# EAGLE schematic schematic_sensors (EAGLE 9.6.1)
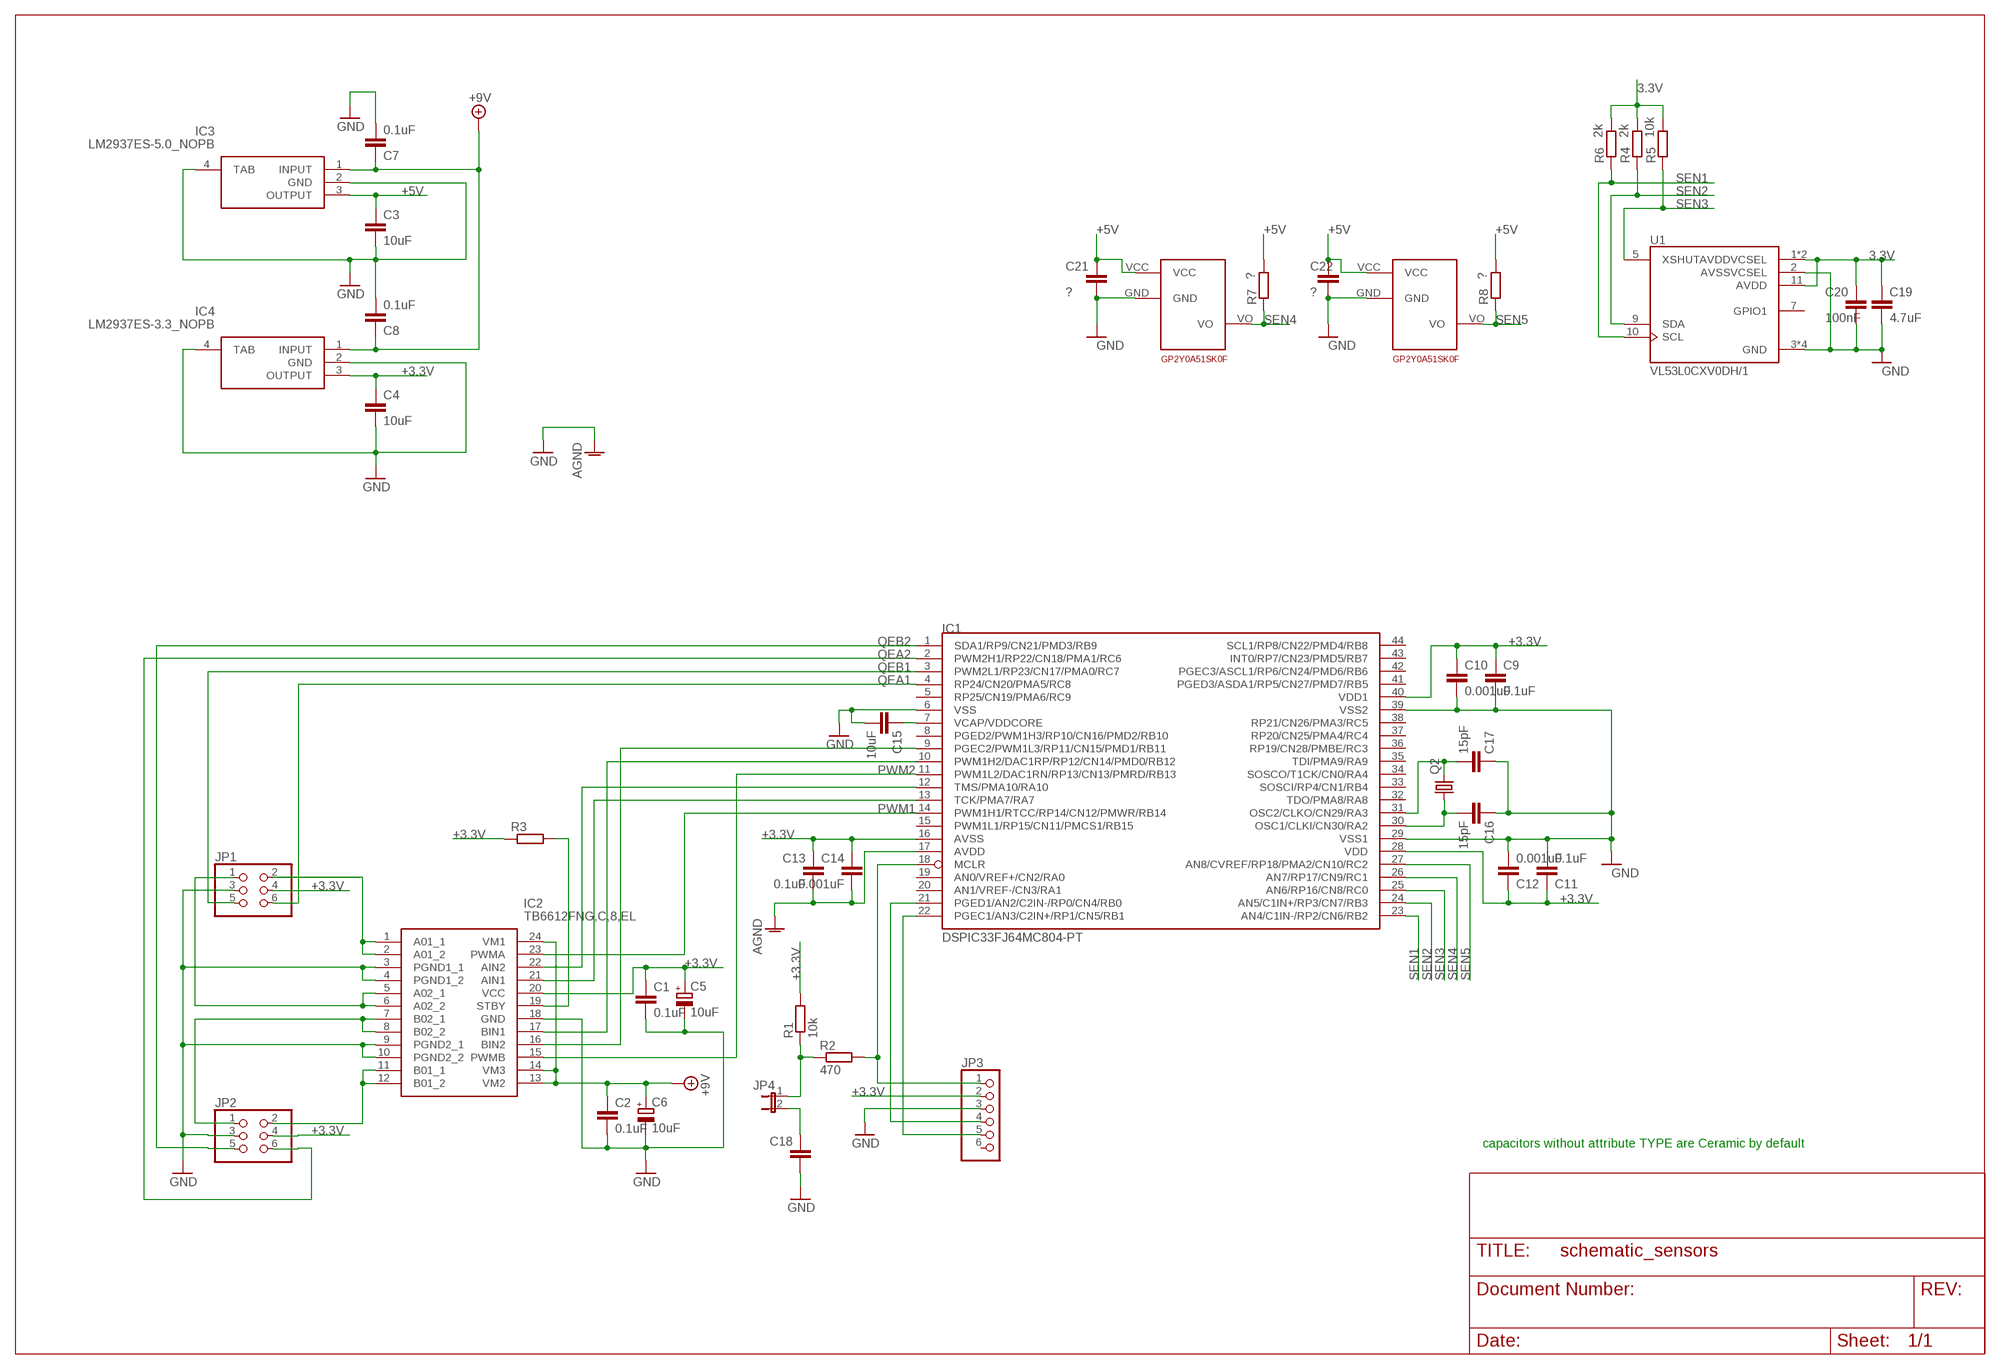
[diagram p0: schematic, sheet 1]

## Parts
C1  0.1uF  C-EUC0805  [C0805]
C2  0.1uF  C-EUC0805  [C0805]
C3  10uF  C-EUC0805  [C0805]
C4  10uF  C-EUC0805  [C0805]
C5  10uF  CPOL-EUE2,5-6E  [E2,5-6E]
C6  10uF  CPOL-EUE2,5-6E  [E2,5-6E]
C7  0.1uF  C-EUC0805  [C0805]
C8  0.1uF  C-EUC0805  [C0805]
C9  0.1uF  C-EUC0805  [C0805]
C10  0.001uF  C-EUC0805  [C0805]
C11  0.1uF  C-EUC0805  [C0805]
C12  0.001uF  C-EUC0805  [C0805]
C13  0.1uF  C-EUC0805  [C0805]
C14  0.001uF  C-EUC0805  [C0805]
C15  10uF  C-EUC0805  [C0805]
C16  15pF  C-EUC0805  [C0805]
C17  15pF  C-EUC0805  [C0805]
C18  C-EUC0805  [C0805]
C19  4.7uF  C-EUC0805  [C0805]
C20  100nF  C-EUC0805  [C0805]
C21  ?  C-EUC0805  [C0805]
C22  ?  C-EUC0805  [C0805]
IC1  DSPIC33FJ64MC804-PT  [TQFP44]
IC2  TB6612FNG,C,8,EL  [SOP65P760X160-24N]
IC3  LM2937ES-5.0_NOPB  [TO254P1435X464-4N]
IC4  LM2937ES-3.3_NOPB  [TO254P1435X464-4N]
JP1  PINHD-2X3  [2X03]
JP2  PINHD-2X3  [2X03]
JP3  PINHD-1X6  [1X06]
JP4  JP1E  [JP1]
Q2  CRYSTALHC49UP  [HC49UP]
R1  10k  R-EU_R0805  [R0805]
R2  470  R-EU_R0805  [R0805]
R3  R-EU_R0805  [R0805]
R4  2k  R-EU_R0805  [R0805]
R5  10k  R-EU_R0805  [R0805]
R6  2k  R-EU_R0805  [R0805]
R7  ?  R-EU_R0805  [R0805]
R8  ?  R-EU_R0805  [R0805]
U1  VL53L0CXV0DH/1  [XDCR_VL53L0CXV0DH/1]
U$1  SHARP_GP2Y0A51SK0F  [SHARP_GP2Y0A51SK0F]
U$2  SHARP_GP2Y0A51SK0F  [SHARP_GP2Y0A51SK0F]

## Nets
3.3V: C19.1 C20.1 R4.2 R5.2 R6.2 U1.1(AVDDVCSEL) U1.1.1(AVDDVCSEL) U1.11(AVDD)
+3.3V: C1.1 C4.1 C5.+ C9.1 C10.1 C11.1 C12.1 C13.1 C14.1 IC1.16(AVSS) IC1.28(VDD) IC1.40(VDD1) IC2.20(VCC) IC4.3(OUTPUT) JP1.4 JP2.4 JP3.2 R1.2 R3.1
+5V: C3.1 C21.1 C22.1 IC3.3(OUTPUT) R7.2 R8.2 U$1.VCC U$2.VCC
+9V: C2.1 C6.+ C7.1 C8.1 IC2.13(VM2) IC2.14(VM3) IC2.24(VM1) IC3.1(INPUT) IC4.1(INPUT)
AGND: C13.2 C14.2 IC1.17(AVDD)
GND: C1.2 C2.2 C3.2 C4.2 C5.- C6.- C7.2 C8.2 C9.2 C10.2 C11.2 C12.2 C15.2 C16.1 C17.1 C18.2 C19.2 C20.2 C21.2 C22.2 IC1.6(VSS) IC1.29(VSS1) IC1.39(VSS2) IC2.3(PGND1_1) IC2.4(PGND1_2) IC2.9(PGND2_1) IC2.10(PGND2_2) IC2.18(GND) IC3.2(GND) IC3.4(TAB) IC4.2(GND) IC4.4(TAB) JP1.3 JP2.3 JP3.3 U1.2(AVSSVCSEL) U1.3(GND) U1.4(GND) U1.6(GND) U1.12(GND) U$1.GND U$2.GND ; supply symbol labelled AGND
N$2: IC2.19(STBY) R3.2
N$4: IC2.1(A01_1) IC2.2(A01_2) JP1.2
N$6: IC2.5(A02_1) IC2.6(A02_2) JP1.1
N$7: C16.2 IC1.30(OSC1/CLKI/CN30/RA2) Q2.1
N$8: JP4.1 R1.1 R2.1
N$9: IC2.11(B01_1) IC2.12(B01_2) JP2.2
N$10: IC2.7(B02_1) IC2.8(B02_2) JP2.1
N$11: C17.2 IC1.31(OSC2/CLKO/CN29/RA3) Q2.2
N$12: C18.1 JP4.2
N$13: IC1.21(PGED1/AN2/C2IN-/RP0/CN4/RB0) JP3.4
N$14: IC1.22(PGEC1/AN3/C2IN+/RP1/CN5/RB1) JP3.5
N$15: IC1.18(MCLR) JP3.1 R2.2
N$16: IC1.13(TCK/PMA7/RA7) IC2.21(AIN1)
N$17: IC1.12(TMS/PMA10/RA10) IC2.22(AIN2)
N$18: IC1.9(PGEC2/PWM1L3/RP11/CN15/PMD1/RB11) IC2.16(BIN2)
N$19: IC1.10(PWM1H2/DAC1RP/RP12/CN14/PMD0/RB12) IC2.17(BIN1)
PWM1: IC1.14(PWM1H1/RTCC/RP14/CN12/PMWR/RB14) IC2.23(PWMA)
PWM2: IC1.11(PWM1L2/DAC1RN/RP13/CN13/PMRD/RB13) IC2.15(PWMB)
QEA1: IC1.4(RP24/CN20/PMA5/RC8) JP1.6
QEA2: IC1.2(PWM2H1/RP22/CN18/PMA1/RC6) JP2.6
QEB1: IC1.3(PWM2L1/RP23/CN17/PMA0/RC7) JP1.5
QEB2: IC1.1(SDA1/RP9/CN21/PMD3/RB9) JP2.5
SEN1: IC1.23(AN4/C1IN-/RP2/CN6/RB2) R6.1 U1.10(SCL)
SEN2: IC1.24(AN5/C1IN+/RP3/CN7/RB3) R4.1 U1.9(SDA)
SEN3: IC1.25(AN6/RP16/CN8/RC0) R5.1 U1.5(XSHUT)
SEN4: IC1.26(AN7/RP17/CN9/RC1) R7.1 U$2.VO
SEN5: IC1.27(AN8/CVREF/RP18/PMA2/CN10/RC2) R8.1 U$1.VO
VCAP/VDDCORE: C15.1 IC1.7(VCAP/VDDCORE)
Unconnected: IC1.5(RP25/CN19/PMA6/RC9) IC1.8(PGED2/PWM1H3/RP10/CN16/PMD2/RB10) IC1.15(PWM1L1/RP15/CN11/PMCS1/RB15) IC1.19(AN0/VREF+/CN2/RA0) IC1.20(AN1/VREF-/CN3/RA1) IC1.32(TDO/PMA8/RA8) IC1.33(SOSCI/RP4/CN1/RB4) IC1.34(SOSCO/T1CK/CN0/RA4) IC1.35(TDI/PMA9/RA9) IC1.36(RP19/CN28/PMBE/RC3) IC1.37(RP20/CN25/PMA4/RC4) IC1.38(RP21/CN26/PMA3/RC5) IC1.41(PGED3/ASDA1/RP5/CN27/PMD7/RB5) IC1.42(PGEC3/ASCL1/RP6/CN24/PMD6/RB6) IC1.43(INT0/RP7/CN23/PMD5/RB7) IC1.44(SCL1/RP8/CN22/PMD4/RB8) JP3.6 U1.7(GPIO1)

## Notes on the sheet
- capacitors without attribute TYPE are Ceramic by default

## Library data of the parts
C1 C2 C9-C14 C16 C17 = rcl:C-EU: CAPACITOR, European symbol; SPICEPREFIX: C
C3 C4 C7 C8 C15 C18-C22 = rcl:C-EU: CAPACITOR, European symbol; SPICEPREFIX: C; TYPE: Tantalum
C5 C6 = rcl:CPOL-EU: POLARIZED CAPACITOR, European symbol; SPICEPREFIX: C
IC1 = microchip-dspic33fjxxmc:DSPIC33FJ64MC804: dsPIC33FJ32MC302/304, dsPIC33FJ64MCX02/X04, AND dsPIC33FJ128MCX02/X04 High-Performance, 16-bit Digital Signal Controllers Package:44 Pin TQFP Operating Range: * Up to 40 MIPS operation (at 3.0V -3.6V): - Industrial temperature range (-40°C to +85°C) - Extended temperature range (-40°C to +125°C) High-Performance DSC CPU: * Modified Harvard architecture * C compiler optimized instruction set * 16-bit wide data path * 24-bit wide instructions * Linear program memory addressing up to 4M instruction words * Linear data memory addressing up to 64 Kbytes * 83 base instructions: mostly 1 word/1 cycle * Two 40-bit accumulators with rounding and saturation options * Flexible and powerful addressing modes: - Indirect - Modulo - Bit-Reversed * Software stack * 16 x 16 fractional/integer multiply operations * 32/16 and 16/16 divide operations * Single-cycle multiply and accumulate: - Accumulator write back for DSP operations - Dual data fetch * Up to ±16-bit shifts for up to 40-bit data Direct Memory Access (DMA): * 8-channel hardware DMA * Up to 2 Kbytes dual ported DMA buffer area (DMA RAM) to store data transferred via DMA: - Allows data transfer between RAM and a peripheral while CPU is executing code (no cycle stealing) * Most peripherals support DMA Timers/Capture/Compare/PWM: * Timer/Counters, up to five 16-bit timers: - Can pair up to make two 32-bit timers - One timer runs as a Real-Time Clock with an external 32.768 kHz oscillator - Programmable prescaler * Input Capture (up to four channels): - Capture on up, down or both edges - 16-bit capture input functions - 4-deep FIFO on each capture * Output Compare (up to four channels): - Single or Dual 16-bit Compare mode - 16-bit Glitchless PWM mode * Hardware Real-Time Clock/Calendar (RTCC): - Provides clock, calendar, and alarm functions Interrupt Controller: * 5-cycle latency * Up to 53 available interrupt sources * Up to three external interrupts * Seven programmable priority levels * Five processor exceptions Digital I/O: * Peripheral pin Select functionality * Up to 35 programmable digital I/O pins * Wake-up/Interrupt-on-Change for up to 31 pins * Output pins can drive from 3.0V to 3.6V * Up to 5V output with open drain configuration * All digital input pins are 5V tolerant * 4 mA sink on all I/O pins On-Chip Flash and SRAM: * Flash program memory (up to 128 Kbytes) * Data SRAM (up to 16 Kbytes) * Boot, Secure, and General Security for program Flash System Management: * Flexible clock options: - External, crystal, resonator, internal RC - Fully integrated Phase-Locked Loop (PLL) - Extremely low jitter PLL * Power-up Timer * Oscillator Start-up Timer/Stabilizer * Watchdog Timer with its own RC oscillator * Fail-Safe Clock Monitor * Reset by multiple sources Power Management: * On-chip 2.5V voltage regulator * Switch between clock sources in real time * Idle, Sleep, and Doze modes with fast wake-up Analog-to-Digital Converters (ADCs): * 10-bit, 1.1 Msps or 12-bit, 500 Ksps conversion: - Two and four simultaneous samples (10-bit ADC) - Up to nine input channels with auto-scanning - Conversion start can be manual or synchronized with one of four trigger sources - Conversion possible in Sleep mode - ±2 LSb max integral nonlinearity - ±1 LSb max differential nonlinearity Audio Digital-to-Analog Converter (DAC): - 16-bit Dual Channel DAC module - 100 Ksps maximum sampling rate - Second-Order Digital Delta-Sigma Modulator Comparator Module: * Two analog comparators with programmable input/output configuration CMOS Flash Technology: * Low-power, high-speed Flash technology * Fully static design * 3.3V (±10%) operating voltage * Industrial and Extended temperature * Low power consumption Motor Control Peripherals: * 6-channel 16-bit Motor Control PWM: - Three duty cycle generators - Independent or Complementary mode - Programmable dead-time and output polarity - Edge-aligned or center-aligned - Manual output override control - One Fault input - Trigger for ADC conversions - PWM frequency for 16-bit resolution (@ 40 MIPS) = 1220 Hz for Edge-Aligned mode, 610 Hz for Center-Aligned mode - PWM frequency for 11-bit resolution (@ 40 MIPS) = 39.1 kHz for Edge-Aligned mode, 19.55 kHz for Center-Aligned mode * 2-channel 16-bit Motor Control PWM: - One duty cycle generator - Independent or Complementary mode - Programmable dead time and output polarity - Edge-aligned or center-aligned - Manual output override control - One Fault input - Trigger for ADC conversions - PWM frequency for 16-bit resolution (@ 40 MIPS) = 1220 Hz for Edge-Aligned mode, 610 Hz for Center-Aligned mode - PWM frequency for 11-bit resolution (@ 40 MIPS) = 39.1 kHz for Edge-Aligned mode, 19.55 kHz for Center-Aligned mode * 2-Quadrature Encoder Interface module: - Phase A, Phase B, and index pulse input - 16-bit up/down position counter - Count direction status - Position Measurement (x2 and x4) mode - Programmable digital noise filters on inputs - Alternate 16-bit Timer/Counter mode - Interrupt on position counter rollover/underflow
IC2 = SamacSys_Parts:TB6612FNG,C,8,EL: otor / Motion / Ignition Controllers & Drivers Brush Motor Driver IC Source: Datasheet <http://toshiba.semicon-storage.com/info/docget.jsp?did=10660&prodName=TB6612FNG>; DESCRIPTION: otor / Motion / Ignition Controllers & Drivers Brush Motor Driver IC; HEIGHT: 1.6mm; MANUFACTURER_NAME: Toshiba; MANUFACTURER_PART_NUMBER: TB6612FNG,C,8,EL; MOUSER_PART_NUMBER: 757-TB6612FNGC8EL; MOUSER_PRICE-STOCK: https://www.mouser.co.uk/ProductDetail/Toshiba/TB6612FNGC8EL?qs=rsevcuukUAy2UalRuv4E%2FQ%3D%3D
IC3 = SamacSys_Parts:LM2937ES-5.0_NOPB: 500mA,5V,LDO Voltage Reg.,LM2937ES-5.0 Source: Datasheet <http://www.ti.com/lit/ds/symlink/lm2937.pdf>; DESCRIPTION: 500mA,5V,LDO Voltage Reg.,LM2937ES-5.0; HEIGHT: 4.64mm; MANUFACTURER_NAME: Texas Instruments; MANUFACTURER_PART_NUMBER: LM2937ES-5.0/NOPB; MOUSER_PART_NUMBER: 926-LM2937ES-5.0NOPB; MOUSER_PRICE-STOCK: https://www.mouser.co.uk/ProductDetail/Texas-Instruments/LM2937ES-50-NOPB?qs=X1J7HmVL2ZE4orr5bA%2Fm4A%3D%3D
IC4 = SamacSys_Parts:LM2937ES-3.3_NOPB: 500mA,3.3V,LDO Voltage Reg.,LM2937ES-3.3 Source: Datasheet <http://www.ti.com/lit/ds/symlink/lm2937-3.3.pdf>; DESCRIPTION: 500mA,3.3V,LDO Voltage Reg.,LM2937ES-3.3; HEIGHT: 4.64mm; MANUFACTURER_NAME: Texas Instruments; MANUFACTURER_PART_NUMBER: LM2937ES-3.3/NOPB; MOUSER_PART_NUMBER: 926-LM2937ES-3.3NOPB; MOUSER_PRICE-STOCK: https://www.mouser.co.uk/ProductDetail/Texas-Instruments/LM2937ES-33-NOPB?qs=X1J7HmVL2ZHutqWEheHOAw%3D%3D
JP1 JP2 = pinhead:PINHD-2X3: PIN HEADER
JP3 = pinhead:PINHD-1X6: PIN HEADER
JP4 = jumper:JP1E: JUMPER
Q2 = crystal:CRYSTAL: CRYSTAL; OC_FARNELL: unknown; OC_NEWARK: unknown
R1-R8 = rcl:R-EU_: RESISTOR, European symbol; SPICEPREFIX: R
U1 = VL53L0CXV0DH_1:VL53L0CXV0DH/1: World smallest Time-of-Flight ranging and gesture detection sensor; ARROW_ELECTRONICS-PURCHASE-URL: https://snapeda.com/shop?store=Arrow+Electronics&id=555540; AVAILABILITY: Unavailable; DESCRIPTION: Optical Sensor 200cm I²C Output; DIGIKEY-PURCHASE-URL: https://snapeda.com/shop?store=DigiKey&id=555540; MF: STMicroelectronics; MOUSER-PURCHASE-URL: https://snapeda.com/shop?store=Mouser&id=555540; MP: VL53L0CXV0DH/1; PACKAGE: LGA-12 STMicroelectronics; PRICE: None
U$1 U$2 = GP2Y0A51SK0F:SHARP_GP2Y0A51SK0F